# Altium schematic sheet RGB.SchDoc
size A4; SheetNumber: 3; SheetTotal: 4
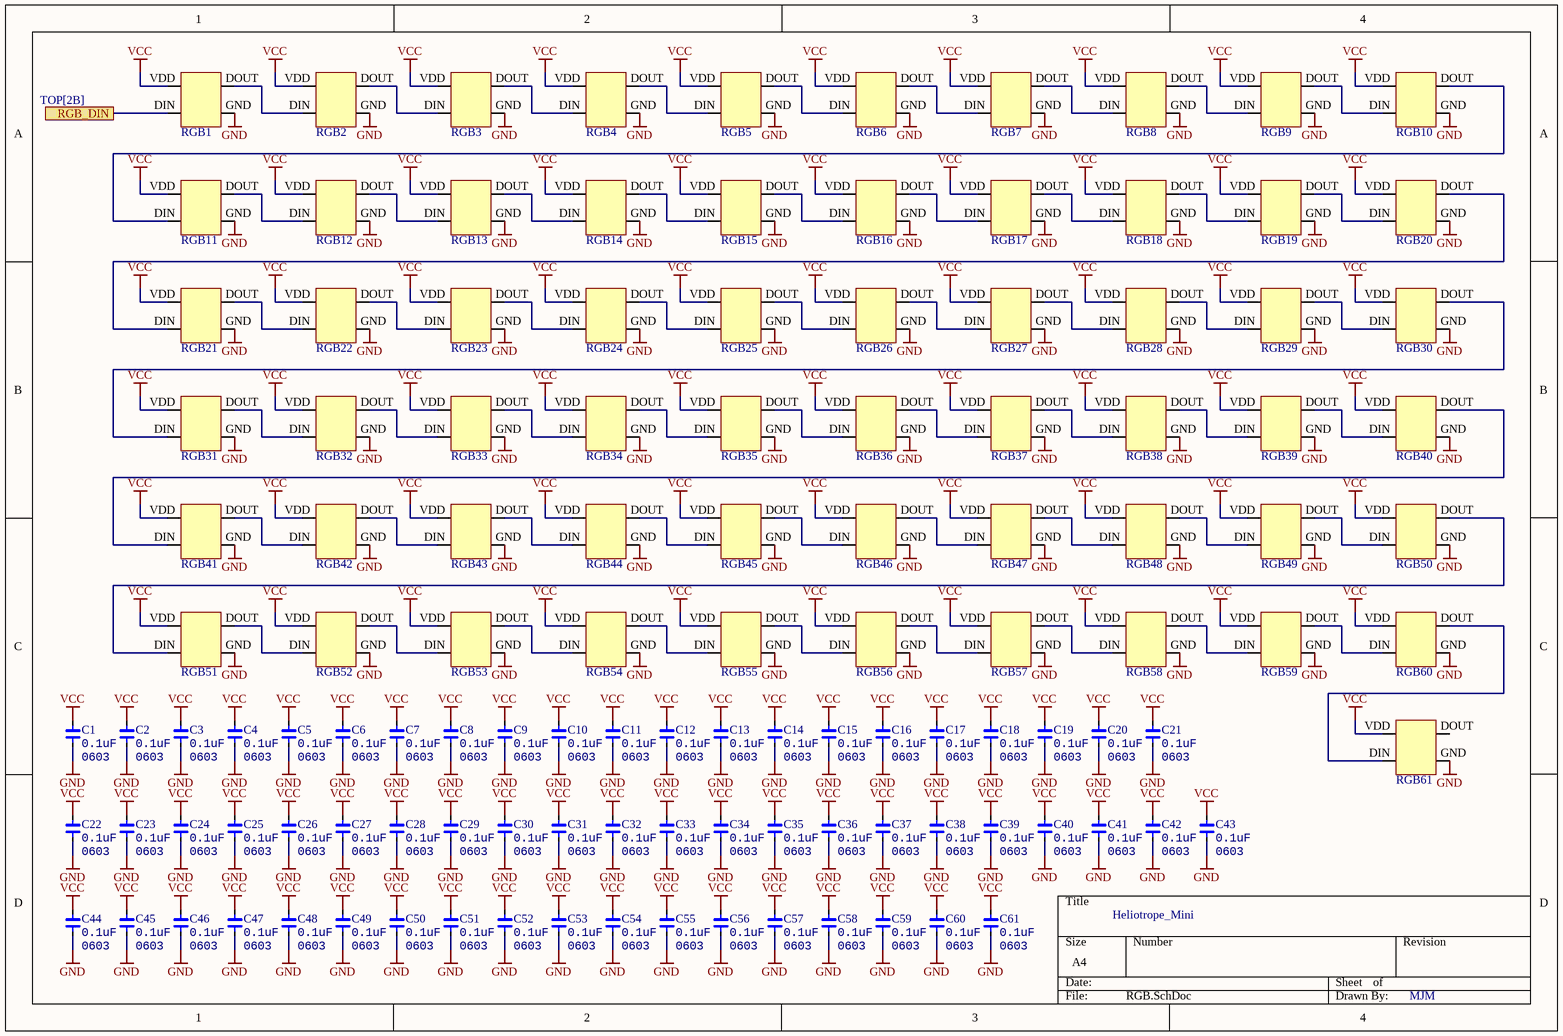
[diagram p0: RGB.SchDoc]

## Parts
C1  value 0.1uF  Type: 0603  [FP-CC0603-DA-MFG]  (hidden comment: CC0603JRX7R9BB104)
C2  value 0.1uF  Type: 0603  [FP-CC0603-DA-MFG]  (hidden comment: CC0603JRX7R9BB104)
C3  value 0.1uF  Type: 0603  [FP-CC0603-DA-MFG]  (hidden comment: CC0603JRX7R9BB104)
C4  value 0.1uF  Type: 0603  [FP-CC0603-DA-MFG]  (hidden comment: CC0603JRX7R9BB104)
C5  value 0.1uF  Type: 0603  [FP-CC0603-DA-MFG]  (hidden comment: CC0603JRX7R9BB104)
C6  value 0.1uF  Type: 0603  [FP-CC0603-DA-MFG]  (hidden comment: CC0603JRX7R9BB104)
C7  value 0.1uF  Type: 0603  [FP-CC0603-DA-MFG]  (hidden comment: CC0603JRX7R9BB104)
C8  value 0.1uF  Type: 0603  [FP-CC0603-DA-MFG]  (hidden comment: CC0603JRX7R9BB104)
C9  value 0.1uF  Type: 0603  [FP-CC0603-DA-MFG]  (hidden comment: CC0603JRX7R9BB104)
C10  value 0.1uF  Type: 0603  [FP-CC0603-DA-MFG]  (hidden comment: CC0603JRX7R9BB104)
C11  value 0.1uF  Type: 0603  [FP-CC0603-DA-MFG]  (hidden comment: CC0603JRX7R9BB104)
C12  value 0.1uF  Type: 0603  [FP-CC0603-DA-MFG]  (hidden comment: CC0603JRX7R9BB104)
C13  value 0.1uF  Type: 0603  [FP-CC0603-DA-MFG]  (hidden comment: CC0603JRX7R9BB104)
C14  value 0.1uF  Type: 0603  [FP-CC0603-DA-MFG]  (hidden comment: CC0603JRX7R9BB104)
C15  value 0.1uF  Type: 0603  [FP-CC0603-DA-MFG]  (hidden comment: CC0603JRX7R9BB104)
C16  value 0.1uF  Type: 0603  [FP-CC0603-DA-MFG]  (hidden comment: CC0603JRX7R9BB104)
C17  value 0.1uF  Type: 0603  [FP-CC0603-DA-MFG]  (hidden comment: CC0603JRX7R9BB104)
C18  value 0.1uF  Type: 0603  [FP-CC0603-DA-MFG]  (hidden comment: CC0603JRX7R9BB104)
C19  value 0.1uF  Type: 0603  [FP-CC0603-DA-MFG]  (hidden comment: CC0603JRX7R9BB104)
C20  value 0.1uF  Type: 0603  [FP-CC0603-DA-MFG]  (hidden comment: CC0603JRX7R9BB104)
C21  value 0.1uF  Type: 0603  [FP-CC0603-DA-MFG]  (hidden comment: CC0603JRX7R9BB104)
C22  value 0.1uF  Type: 0603  [FP-CC0603-DA-MFG]  (hidden comment: CC0603JRX7R9BB104)
C23  value 0.1uF  Type: 0603  [FP-CC0603-DA-MFG]  (hidden comment: CC0603JRX7R9BB104)
C24  value 0.1uF  Type: 0603  [FP-CC0603-DA-MFG]  (hidden comment: CC0603JRX7R9BB104)
C25  value 0.1uF  Type: 0603  [FP-CC0603-DA-MFG]  (hidden comment: CC0603JRX7R9BB104)
C26  value 0.1uF  Type: 0603  [FP-CC0603-DA-MFG]  (hidden comment: CC0603JRX7R9BB104)
C27  value 0.1uF  Type: 0603  [FP-CC0603-DA-MFG]  (hidden comment: CC0603JRX7R9BB104)
C28  value 0.1uF  Type: 0603  [FP-CC0603-DA-MFG]  (hidden comment: CC0603JRX7R9BB104)
C29  value 0.1uF  Type: 0603  [FP-CC0603-DA-MFG]  (hidden comment: CC0603JRX7R9BB104)
C30  value 0.1uF  Type: 0603  [FP-CC0603-DA-MFG]  (hidden comment: CC0603JRX7R9BB104)
C31  value 0.1uF  Type: 0603  [FP-CC0603-DA-MFG]  (hidden comment: CC0603JRX7R9BB104)
C32  value 0.1uF  Type: 0603  [FP-CC0603-DA-MFG]  (hidden comment: CC0603JRX7R9BB104)
C33  value 0.1uF  Type: 0603  [FP-CC0603-DA-MFG]  (hidden comment: CC0603JRX7R9BB104)
C34  value 0.1uF  Type: 0603  [FP-CC0603-DA-MFG]  (hidden comment: CC0603JRX7R9BB104)
C35  value 0.1uF  Type: 0603  [FP-CC0603-DA-MFG]  (hidden comment: CC0603JRX7R9BB104)
C36  value 0.1uF  Type: 0603  [FP-CC0603-DA-MFG]  (hidden comment: CC0603JRX7R9BB104)
C37  value 0.1uF  Type: 0603  [FP-CC0603-DA-MFG]  (hidden comment: CC0603JRX7R9BB104)
C38  value 0.1uF  Type: 0603  [FP-CC0603-DA-MFG]  (hidden comment: CC0603JRX7R9BB104)
C39  value 0.1uF  Type: 0603  [FP-CC0603-DA-MFG]  (hidden comment: CC0603JRX7R9BB104)
C40  value 0.1uF  Type: 0603  [FP-CC0603-DA-MFG]  (hidden comment: CC0603JRX7R9BB104)
C41  value 0.1uF  Type: 0603  [FP-CC0603-DA-MFG]  (hidden comment: CC0603JRX7R9BB104)
C42  value 0.1uF  Type: 0603  [FP-CC0603-DA-MFG]  (hidden comment: CC0603JRX7R9BB104)
C43  value 0.1uF  Type: 0603  [FP-CC0603-DA-MFG]  (hidden comment: CC0603JRX7R9BB104)
C44  value 0.1uF  Type: 0603  [FP-CC0603-DA-MFG]  (hidden comment: CC0603JRX7R9BB104)
C45  value 0.1uF  Type: 0603  [FP-CC0603-DA-MFG]  (hidden comment: CC0603JRX7R9BB104)
C46  value 0.1uF  Type: 0603  [FP-CC0603-DA-MFG]  (hidden comment: CC0603JRX7R9BB104)
C47  value 0.1uF  Type: 0603  [FP-CC0603-DA-MFG]  (hidden comment: CC0603JRX7R9BB104)
C48  value 0.1uF  Type: 0603  [FP-CC0603-DA-MFG]  (hidden comment: CC0603JRX7R9BB104)
C49  value 0.1uF  Type: 0603  [FP-CC0603-DA-MFG]  (hidden comment: CC0603JRX7R9BB104)
C50  value 0.1uF  Type: 0603  [FP-CC0603-DA-MFG]  (hidden comment: CC0603JRX7R9BB104)
C51  value 0.1uF  Type: 0603  [FP-CC0603-DA-MFG]  (hidden comment: CC0603JRX7R9BB104)
C52  value 0.1uF  Type: 0603  [FP-CC0603-DA-MFG]  (hidden comment: CC0603JRX7R9BB104)
C53  value 0.1uF  Type: 0603  [FP-CC0603-DA-MFG]  (hidden comment: CC0603JRX7R9BB104)
C54  value 0.1uF  Type: 0603  [FP-CC0603-DA-MFG]  (hidden comment: CC0603JRX7R9BB104)
C55  value 0.1uF  Type: 0603  [FP-CC0603-DA-MFG]  (hidden comment: CC0603JRX7R9BB104)
C56  value 0.1uF  Type: 0603  [FP-CC0603-DA-MFG]  (hidden comment: CC0603JRX7R9BB104)
C57  value 0.1uF  Type: 0603  [FP-CC0603-DA-MFG]  (hidden comment: CC0603JRX7R9BB104)
C58  value 0.1uF  Type: 0603  [FP-CC0603-DA-MFG]  (hidden comment: CC0603JRX7R9BB104)
C59  value 0.1uF  Type: 0603  [FP-CC0603-DA-MFG]  (hidden comment: CC0603JRX7R9BB104)
C60  value 0.1uF  Type: 0603  [FP-CC0603-DA-MFG]  (hidden comment: CC0603JRX7R9BB104)
C61  value 0.1uF  Type: 0603  [FP-CC0603-DA-MFG]  (hidden comment: CC0603JRX7R9BB104)
RGB1  SK6812MINI-E  [sk6812minie]  (value not drawn)
RGB2  SK6812MINI-E  [sk6812minie]  (value not drawn)
RGB3  SK6812MINI-E  [sk6812minie]  (value not drawn)
RGB4  SK6812MINI-E  [sk6812minie]  (value not drawn)
RGB5  SK6812MINI-E  [sk6812minie]  (value not drawn)
RGB6  SK6812MINI-E  [sk6812minie]  (value not drawn)
RGB7  SK6812MINI-E  [sk6812minie]  (value not drawn)
RGB8  SK6812MINI-E  [sk6812minie]  (value not drawn)
RGB9  SK6812MINI-E  [sk6812minie]  (value not drawn)
RGB10  SK6812MINI-E  [sk6812minie]  (value not drawn)
RGB11  SK6812MINI-E  [sk6812minie]  (value not drawn)
RGB12  SK6812MINI-E  [sk6812minie]  (value not drawn)
RGB13  SK6812MINI-E  [sk6812minie]  (value not drawn)
RGB14  SK6812MINI-E  [sk6812minie]  (value not drawn)
RGB15  SK6812MINI-E  [sk6812minie]  (value not drawn)
RGB16  SK6812MINI-E  [sk6812minie]  (value not drawn)
RGB17  SK6812MINI-E  [sk6812minie]  (value not drawn)
RGB18  SK6812MINI-E  [sk6812minie]  (value not drawn)
RGB19  SK6812MINI-E  [sk6812minie]  (value not drawn)
RGB20  SK6812MINI-E  [sk6812minie]  (value not drawn)
RGB21  SK6812MINI-E  [sk6812minie]  (value not drawn)
RGB22  SK6812MINI-E  [sk6812minie]  (value not drawn)
RGB23  SK6812MINI-E  [sk6812minie]  (value not drawn)
RGB24  SK6812MINI-E  [sk6812minie]  (value not drawn)
RGB25  SK6812MINI-E  [sk6812minie]  (value not drawn)
RGB26  SK6812MINI-E  [sk6812minie]  (value not drawn)
RGB27  SK6812MINI-E  [sk6812minie]  (value not drawn)
RGB28  SK6812MINI-E  [sk6812minie]  (value not drawn)
RGB29  SK6812MINI-E  [sk6812minie]  (value not drawn)
RGB30  SK6812MINI-E  [sk6812minie]  (value not drawn)
RGB31  SK6812MINI-E  [sk6812minie]  (value not drawn)
RGB32  SK6812MINI-E  [sk6812minie]  (value not drawn)
RGB33  SK6812MINI-E  [sk6812minie]  (value not drawn)
RGB34  SK6812MINI-E  [sk6812minie]  (value not drawn)
RGB35  SK6812MINI-E  [sk6812minie]  (value not drawn)
RGB36  SK6812MINI-E  [sk6812minie]  (value not drawn)
RGB37  SK6812MINI-E  [sk6812minie]  (value not drawn)
RGB38  SK6812MINI-E  [sk6812minie]  (value not drawn)
RGB39  SK6812MINI-E  [sk6812minie]  (value not drawn)
RGB40  SK6812MINI-E  [sk6812minie]  (value not drawn)
RGB41  SK6812MINI-E  [sk6812minie]  (value not drawn)
RGB42  SK6812MINI-E  [sk6812minie]  (value not drawn)
RGB43  SK6812MINI-E  [sk6812minie]  (value not drawn)
RGB44  SK6812MINI-E  [sk6812minie]  (value not drawn)
RGB45  SK6812MINI-E  [sk6812minie]  (value not drawn)
RGB46  SK6812MINI-E  [sk6812minie]  (value not drawn)
RGB47  SK6812MINI-E  [sk6812minie]  (value not drawn)
RGB48  SK6812MINI-E  [sk6812minie]  (value not drawn)
RGB49  SK6812MINI-E  [sk6812minie]  (value not drawn)
RGB50  SK6812MINI-E  [sk6812minie]  (value not drawn)
RGB51  SK6812MINI-E  [sk6812minie]  (value not drawn)
RGB52  SK6812MINI-E  [sk6812minie]  (value not drawn)
RGB53  SK6812MINI-E  [sk6812minie]  (value not drawn)
RGB54  SK6812MINI-E  [sk6812minie]  (value not drawn)
RGB55  SK6812MINI-E  [sk6812minie]  (value not drawn)
RGB56  SK6812MINI-E  [sk6812minie]  (value not drawn)
RGB57  SK6812MINI-E  [sk6812minie]  (value not drawn)
RGB58  SK6812MINI-E  [sk6812minie]  (value not drawn)
RGB59  SK6812MINI-E  [sk6812minie]  (value not drawn)
RGB60  SK6812MINI-E  [sk6812minie]  (value not drawn)
RGB61  SK6812MINI-E  [sk6812minie]  (value not drawn)

## Ports
RGB_DIN (see TOP[2B])

## Nets
GND: C1.1 C2.1 C3.1 C4.1 C5.1 C6.1 C7.1 C8.1 C9.1 C10.1 C11.1 C12.1 C13.1 C14.1 C15.1 C16.1 C17.1 C18.1 C19.1 C20.1 C21.1 C22.1 C23.1 C24.1 C25.1 C26.1 C27.1 C28.1 C29.1 C30.1 C31.1 C32.1 C33.1 C34.1 C35.1 C36.1 C37.1 C38.1 C39.1 C40.1 C41.1 C42.1 C43.1 C44.1 C45.1 C46.1 C47.1 C48.1 C49.1 C50.1 C51.1 C52.1 C53.1 C54.1 C55.1 C56.1 C57.1 C58.1 C59.1 C60.1 C61.1 RGB1.GND RGB2.GND RGB3.GND RGB4.GND RGB5.GND RGB6.GND RGB7.GND RGB8.GND RGB9.GND RGB10.GND RGB11.GND RGB12.GND RGB13.GND RGB14.GND RGB15.GND RGB16.GND RGB17.GND RGB18.GND RGB19.GND RGB20.GND RGB21.GND RGB22.GND RGB23.GND RGB24.GND RGB25.GND RGB26.GND RGB27.GND RGB28.GND RGB29.GND RGB30.GND RGB31.GND RGB32.GND RGB33.GND RGB34.GND RGB35.GND RGB36.GND RGB37.GND RGB38.GND RGB39.GND RGB40.GND RGB41.GND RGB42.GND RGB43.GND RGB44.GND RGB45.GND RGB46.GND RGB47.GND RGB48.GND RGB49.GND RGB50.GND RGB51.GND RGB52.GND RGB53.GND RGB54.GND RGB55.GND RGB56.GND RGB57.GND RGB58.GND RGB59.GND RGB60.GND RGB61.GND
VCC: C1.2 C2.2 C3.2 C4.2 C5.2 C6.2 C7.2 C8.2 C9.2 C10.2 C11.2 C12.2 C13.2 C14.2 C15.2 C16.2 C17.2 C18.2 C19.2 C20.2 C21.2 C22.2 C23.2 C24.2 C25.2 C26.2 C27.2 C28.2 C29.2 C30.2 C31.2 C32.2 C33.2 C34.2 C35.2 C36.2 C37.2 C38.2 C39.2 C40.2 C41.2 C42.2 C43.2 C44.2 C45.2 C46.2 C47.2 C48.2 C49.2 C50.2 C51.2 C52.2 C53.2 C54.2 C55.2 C56.2 C57.2 C58.2 C59.2 C60.2 C61.2 RGB1.VDD RGB2.VDD RGB3.VDD RGB4.VDD RGB5.VDD RGB6.VDD RGB7.VDD RGB8.VDD RGB9.VDD RGB10.VDD RGB11.VDD RGB12.VDD RGB13.VDD RGB14.VDD RGB15.VDD RGB16.VDD RGB17.VDD RGB18.VDD RGB19.VDD RGB20.VDD RGB21.VDD RGB22.VDD RGB23.VDD RGB24.VDD RGB25.VDD RGB26.VDD RGB27.VDD RGB28.VDD RGB29.VDD RGB30.VDD RGB31.VDD RGB32.VDD RGB33.VDD RGB34.VDD RGB35.VDD RGB36.VDD RGB37.VDD RGB38.VDD RGB39.VDD RGB40.VDD RGB41.VDD RGB42.VDD RGB43.VDD RGB44.VDD RGB45.VDD RGB46.VDD RGB47.VDD RGB48.VDD RGB49.VDD RGB50.VDD RGB51.VDD RGB52.VDD RGB53.VDD RGB54.VDD RGB55.VDD RGB56.VDD RGB57.VDD RGB58.VDD RGB59.VDD RGB60.VDD RGB61.VDD
RGB_DIN: RGB1.DIN ; port RGB_DIN
NetRGB1_DOUT: RGB1.DOUT RGB2.DIN
NetRGB2_DOUT: RGB2.DOUT RGB3.DIN
NetRGB3_DOUT: RGB3.DOUT RGB4.DIN
NetRGB4_DOUT: RGB4.DOUT RGB5.DIN
NetRGB5_DOUT: RGB5.DOUT RGB6.DIN
NetRGB6_DOUT: RGB6.DOUT RGB7.DIN
NetRGB7_DOUT: RGB7.DOUT RGB8.DIN
NetRGB8_DOUT: RGB8.DOUT RGB9.DIN
NetRGB9_DOUT: RGB9.DOUT RGB10.DIN
NetRGB10_DOUT: RGB10.DOUT RGB11.DIN
NetRGB11_DOUT: RGB11.DOUT RGB12.DIN
NetRGB12_DOUT: RGB12.DOUT RGB13.DIN
NetRGB13_DOUT: RGB13.DOUT RGB14.DIN
NetRGB14_DOUT: RGB14.DOUT RGB15.DIN
NetRGB15_DOUT: RGB15.DOUT RGB16.DIN
NetRGB16_DOUT: RGB16.DOUT RGB17.DIN
NetRGB17_DOUT: RGB17.DOUT RGB18.DIN
NetRGB18_DOUT: RGB18.DOUT RGB19.DIN
NetRGB19_DOUT: RGB19.DOUT RGB20.DIN
NetRGB20_DOUT: RGB20.DOUT RGB21.DIN
NetRGB21_DOUT: RGB21.DOUT RGB22.DIN
NetRGB22_DOUT: RGB22.DOUT RGB23.DIN
NetRGB23_DOUT: RGB23.DOUT RGB24.DIN
NetRGB24_DOUT: RGB24.DOUT RGB25.DIN
NetRGB25_DOUT: RGB25.DOUT RGB26.DIN
NetRGB26_DOUT: RGB26.DOUT RGB27.DIN
NetRGB27_DOUT: RGB27.DOUT RGB28.DIN
NetRGB28_DOUT: RGB28.DOUT RGB29.DIN
NetRGB29_DOUT: RGB29.DOUT RGB30.DIN
NetRGB30_DOUT: RGB30.DOUT RGB31.DIN
NetRGB31_DOUT: RGB31.DOUT RGB32.DIN
NetRGB32_DOUT: RGB32.DOUT RGB33.DIN
NetRGB33_DOUT: RGB33.DOUT RGB34.DIN
NetRGB34_DOUT: RGB34.DOUT RGB35.DIN
NetRGB35_DOUT: RGB35.DOUT RGB36.DIN
NetRGB36_DOUT: RGB36.DOUT RGB37.DIN
NetRGB37_DOUT: RGB37.DOUT RGB38.DIN
NetRGB38_DOUT: RGB38.DOUT RGB39.DIN
NetRGB39_DOUT: RGB39.DOUT RGB40.DIN
NetRGB40_DOUT: RGB40.DOUT RGB41.DIN
NetRGB41_DOUT: RGB41.DOUT RGB42.DIN
NetRGB42_DOUT: RGB42.DOUT RGB43.DIN
NetRGB43_DOUT: RGB43.DOUT RGB44.DIN
NetRGB44_DOUT: RGB44.DOUT RGB45.DIN
NetRGB45_DOUT: RGB45.DOUT RGB46.DIN
NetRGB46_DOUT: RGB46.DOUT RGB47.DIN
NetRGB47_DOUT: RGB47.DOUT RGB48.DIN
NetRGB48_DOUT: RGB48.DOUT RGB49.DIN
NetRGB49_DOUT: RGB49.DOUT RGB50.DIN
NetRGB50_DOUT: RGB50.DOUT RGB51.DIN
NetRGB51_DOUT: RGB51.DOUT RGB52.DIN
NetRGB52_DOUT: RGB52.DOUT RGB53.DIN
NetRGB53_DOUT: RGB53.DOUT RGB54.DIN
NetRGB54_DOUT: RGB54.DOUT RGB55.DIN
NetRGB55_DOUT: RGB55.DOUT RGB56.DIN
NetRGB56_DOUT: RGB56.DOUT RGB57.DIN
NetRGB57_DOUT: RGB57.DOUT RGB58.DIN
NetRGB58_DOUT: RGB58.DOUT RGB59.DIN
NetRGB59_DOUT: RGB59.DOUT RGB60.DIN
NetRGB60_DOUT: RGB60.DOUT RGB61.DIN

Not connected (* = marked no-connect by the designer): RGB61 DOUT

## Notes on the sheet
- Heliotrope_Mini
- MJM

## Library data of the parts
C1-C61 = CMP-004-000009-6: 0603 0.1 uF 50 V ±5 % Tolerance X7R SMT Multilayer Ceramic Capacitor
RGB1-RGB61 = CMP-00002-12: Pin Count: 4; Component Type: Standard; Source: SK6812MINI-E.SchLib; Design Item ID: SK6812MINI-E